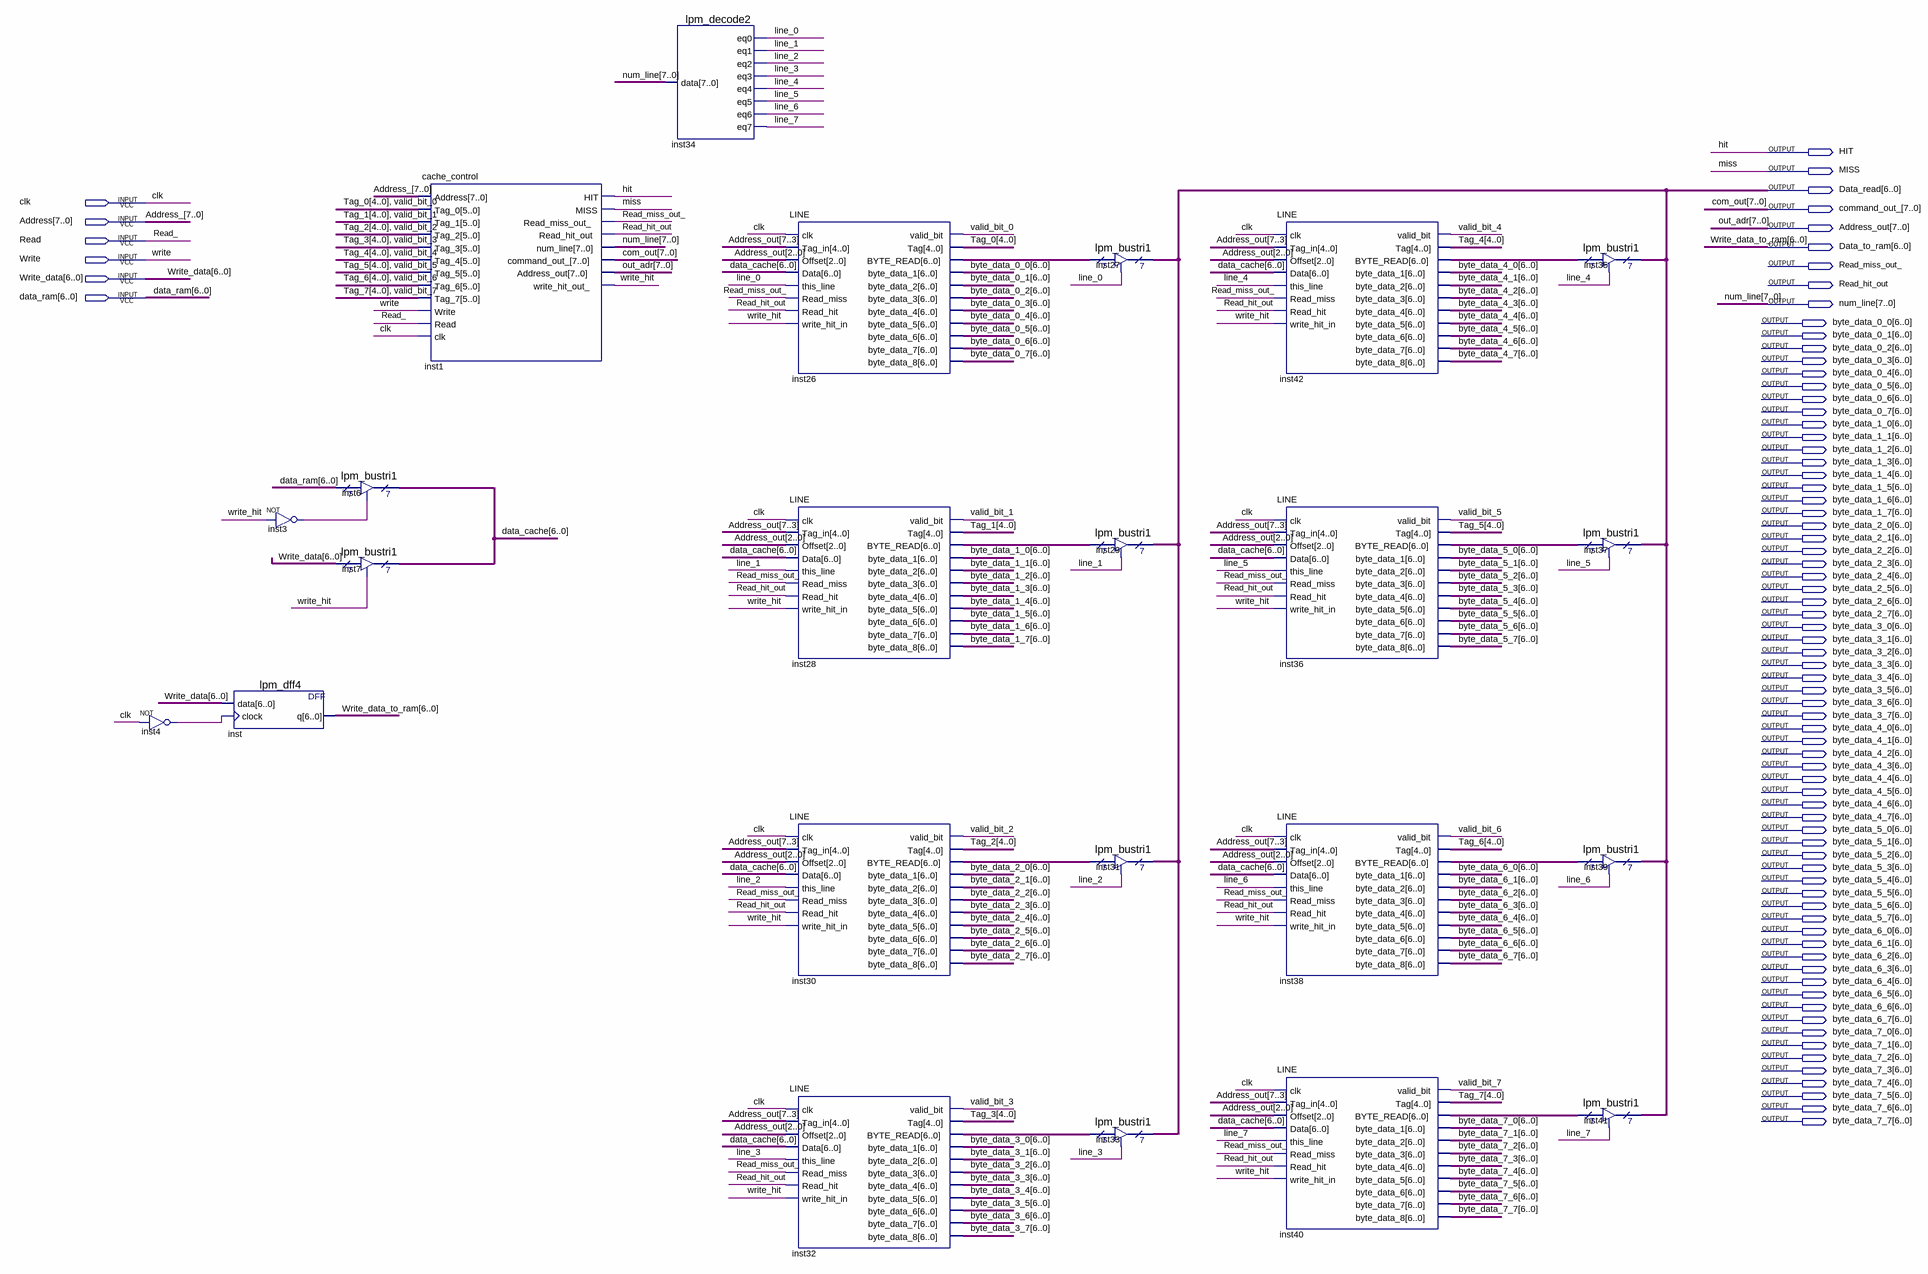
[diagram p0: schematic sheet]
// Quartus schematic CACHE.bdf as structural Verilog: 23 symbols, 79 pins
module CACHE (
  input  clk,
  input  [7:0] Address,
  input  Read,
  input  Write,
  input  [6:0] Write_data,
  input  [6:0] data_ram,
  output HIT,
  output MISS,
  output [6:0] Data_read,
  output [7:0] command_out_,
  output [7:0] Address_out,
  output [6:0] Data_to_ram,
  output Read_miss_out_,
  output Read_hit_out,
  output [7:0] num_line,
  output [6:0] byte_data_0_0,
  output [6:0] byte_data_0_1,
  output [6:0] byte_data_0_2,
  output [6:0] byte_data_0_3,
  output [6:0] byte_data_0_4,
  output [6:0] byte_data_0_5,
  output [6:0] byte_data_0_6,
  output [6:0] byte_data_0_7,
  output [6:0] byte_data_1_0,
  output [6:0] byte_data_1_1,
  output [6:0] byte_data_1_2,
  output [6:0] byte_data_1_3,
  output [6:0] byte_data_1_4,
  output [6:0] byte_data_1_5,
  output [6:0] byte_data_1_6,
  output [6:0] byte_data_1_7,
  output [6:0] byte_data_2_0,
  output [6:0] byte_data_2_1,
  output [6:0] byte_data_2_2,
  output [6:0] byte_data_2_3,
  output [6:0] byte_data_2_4,
  output [6:0] byte_data_2_5,
  output [6:0] byte_data_2_6,
  output [6:0] byte_data_2_7,
  output [6:0] byte_data_3_0,
  output [6:0] byte_data_3_1,
  output [6:0] byte_data_3_2,
  output [6:0] byte_data_3_3,
  output [6:0] byte_data_3_4,
  output [6:0] byte_data_3_5,
  output [6:0] byte_data_3_6,
  output [6:0] byte_data_3_7,
  output [6:0] byte_data_4_0,
  output [6:0] byte_data_4_1,
  output [6:0] byte_data_4_2,
  output [6:0] byte_data_4_3,
  output [6:0] byte_data_4_4,
  output [6:0] byte_data_4_5,
  output [6:0] byte_data_4_6,
  output [6:0] byte_data_4_7,
  output [6:0] byte_data_5_0,
  output [6:0] byte_data_5_1,
  output [6:0] byte_data_5_2,
  output [6:0] byte_data_5_3,
  output [6:0] byte_data_5_4,
  output [6:0] byte_data_5_5,
  output [6:0] byte_data_5_6,
  output [6:0] byte_data_5_7,
  output [6:0] byte_data_6_0,
  output [6:0] byte_data_6_1,
  output [6:0] byte_data_6_2,
  output [6:0] byte_data_6_3,
  output [6:0] byte_data_6_4,
  output [6:0] byte_data_6_5,
  output [6:0] byte_data_6_6,
  output [6:0] byte_data_6_7,
  output [6:0] byte_data_7_0,
  output [6:0] byte_data_7_1,
  output [6:0] byte_data_7_2,
  output [6:0] byte_data_7_3,
  output [6:0] byte_data_7_4,
  output [6:0] byte_data_7_5,
  output [6:0] byte_data_7_6,
  output [6:0] byte_data_7_7
);

  wire inst3_out, inst4_out, line_0, line_1, line_2, line_3, line_4, line_5, line_6, line_7, valid_bit_0,
       valid_bit_1, valid_bit_2, valid_bit_3, valid_bit_4, valid_bit_5, valid_bit_6, valid_bit_7, write_hit;
  wire [4:0] Tag_0, Tag_1, Tag_2, Tag_3, Tag_4, Tag_5, Tag_6, Tag_7;
  wire [6:0] data_cache, inst26_byte_read, inst28_byte_read, inst30_byte_read, inst32_byte_read,
       inst36_byte_read, inst38_byte_read, inst40_byte_read, inst42_byte_read;

  not inst4 (inst4_out, clk);
  lpm_dff4 inst (.data(Write_data), .clock(inst4_out), .q(Data_to_ram));
  not inst3 (inst3_out, write_hit);
  lpm_bustri1 inst6 (.enabledt(inst3_out), .data(data_ram), .tridata(data_cache));
  lpm_bustri1 inst7 (.enabledt(write_hit), .data(Write_data), .tridata(data_cache));
  cache_control inst1 (
    .Address(Address), .Tag_0({Tag_0, valid_bit_0}), .Tag_1({Tag_1, valid_bit_1}),
    .Tag_2({Tag_2, valid_bit_2}), .Tag_3({Tag_3, valid_bit_3}), .Tag_4({Tag_4, valid_bit_4}),
    .Tag_5({Tag_5, valid_bit_5}), .Tag_6({Tag_6, valid_bit_6}), .Tag_7({Tag_7, valid_bit_7}), .Write(Write),
    .Read(Read), .clk(clk), .HIT(HIT), .MISS(MISS), .Read_miss_out_(Read_miss_out_),
    .Read_hit_out(Read_hit_out), .num_line(num_line), .command_out_(command_out_), .Address_out(Address_out),
    .write_hit_out_(write_hit));
  lpm_decode2 inst34 (
    .data(num_line), .eq0(line_0), .eq1(line_1), .eq2(line_2), .eq3(line_3), .eq4(line_4), .eq5(line_5),
    .eq6(line_6), .eq7(line_7));
  LINE inst26 (
    .clk(clk), .Tag_in(Address_out[7:3]), .Offset(Address_out[2:0]), .Data(data_cache), .this_line(line_0),
    .Read_miss(Read_miss_out_), .Read_hit(Read_hit_out), .write_hit_in(write_hit), .valid_bit(valid_bit_0),
    .Tag(Tag_0), .BYTE_READ(inst26_byte_read), .byte_data_1(byte_data_0_0), .byte_data_2(byte_data_0_1),
    .byte_data_3(byte_data_0_2), .byte_data_4(byte_data_0_3), .byte_data_5(byte_data_0_4),
    .byte_data_6(byte_data_0_5), .byte_data_7(byte_data_0_6), .byte_data_8(byte_data_0_7));
  LINE inst28 (
    .clk(clk), .Tag_in(Address_out[7:3]), .Offset(Address_out[2:0]), .Data(data_cache), .this_line(line_1),
    .Read_miss(Read_miss_out_), .Read_hit(Read_hit_out), .write_hit_in(write_hit), .valid_bit(valid_bit_1),
    .Tag(Tag_1), .BYTE_READ(inst28_byte_read), .byte_data_1(byte_data_1_0), .byte_data_2(byte_data_1_1),
    .byte_data_3(byte_data_1_2), .byte_data_4(byte_data_1_3), .byte_data_5(byte_data_1_4),
    .byte_data_6(byte_data_1_5), .byte_data_7(byte_data_1_6), .byte_data_8(byte_data_1_7));
  LINE inst30 (
    .clk(clk), .Tag_in(Address_out[7:3]), .Offset(Address_out[2:0]), .Data(data_cache), .this_line(line_2),
    .Read_miss(Read_miss_out_), .Read_hit(Read_hit_out), .write_hit_in(write_hit), .valid_bit(valid_bit_2),
    .Tag(Tag_2), .BYTE_READ(inst30_byte_read), .byte_data_1(byte_data_2_0), .byte_data_2(byte_data_2_1),
    .byte_data_3(byte_data_2_2), .byte_data_4(byte_data_2_3), .byte_data_5(byte_data_2_4),
    .byte_data_6(byte_data_2_5), .byte_data_7(byte_data_2_6), .byte_data_8(byte_data_2_7));
  LINE inst32 (
    .clk(clk), .Tag_in(Address_out[7:3]), .Offset(Address_out[2:0]), .Data(data_cache), .this_line(line_3),
    .Read_miss(Read_miss_out_), .Read_hit(Read_hit_out), .write_hit_in(write_hit), .valid_bit(valid_bit_3),
    .Tag(Tag_3), .BYTE_READ(inst32_byte_read), .byte_data_1(byte_data_3_0), .byte_data_2(byte_data_3_1),
    .byte_data_3(byte_data_3_2), .byte_data_4(byte_data_3_3), .byte_data_5(byte_data_3_4),
    .byte_data_6(byte_data_3_5), .byte_data_7(byte_data_3_6), .byte_data_8(byte_data_3_7));
  lpm_bustri1 inst27 (.enabledt(line_0), .data(inst26_byte_read), .tridata(Data_read));
  lpm_bustri1 inst29 (.enabledt(line_1), .data(inst28_byte_read), .tridata(Data_read));
  lpm_bustri1 inst31 (.enabledt(line_2), .data(inst30_byte_read), .tridata(Data_read));
  lpm_bustri1 inst33 (.enabledt(line_3), .data(inst32_byte_read), .tridata(Data_read));
  LINE inst42 (
    .clk(clk), .Tag_in(Address_out[7:3]), .Offset(Address_out[2:0]), .Data(data_cache), .this_line(line_4),
    .Read_miss(Read_miss_out_), .Read_hit(Read_hit_out), .write_hit_in(write_hit), .valid_bit(valid_bit_4),
    .Tag(Tag_4), .BYTE_READ(inst42_byte_read), .byte_data_1(byte_data_4_0), .byte_data_2(byte_data_4_1),
    .byte_data_3(byte_data_4_2), .byte_data_4(byte_data_4_3), .byte_data_5(byte_data_4_4),
    .byte_data_6(byte_data_4_5), .byte_data_7(byte_data_4_6), .byte_data_8(byte_data_4_7));
  LINE inst36 (
    .clk(clk), .Tag_in(Address_out[7:3]), .Offset(Address_out[2:0]), .Data(data_cache), .this_line(line_5),
    .Read_miss(Read_miss_out_), .Read_hit(Read_hit_out), .write_hit_in(write_hit), .valid_bit(valid_bit_5),
    .Tag(Tag_5), .BYTE_READ(inst36_byte_read), .byte_data_1(byte_data_5_0), .byte_data_2(byte_data_5_1),
    .byte_data_3(byte_data_5_2), .byte_data_4(byte_data_5_3), .byte_data_5(byte_data_5_4),
    .byte_data_6(byte_data_5_5), .byte_data_7(byte_data_5_6), .byte_data_8(byte_data_5_7));
  LINE inst38 (
    .clk(clk), .Tag_in(Address_out[7:3]), .Offset(Address_out[2:0]), .Data(data_cache), .this_line(line_6),
    .Read_miss(Read_miss_out_), .Read_hit(Read_hit_out), .write_hit_in(write_hit), .valid_bit(valid_bit_6),
    .Tag(Tag_6), .BYTE_READ(inst38_byte_read), .byte_data_1(byte_data_6_0), .byte_data_2(byte_data_6_1),
    .byte_data_3(byte_data_6_2), .byte_data_4(byte_data_6_3), .byte_data_5(byte_data_6_4),
    .byte_data_6(byte_data_6_5), .byte_data_7(byte_data_6_6), .byte_data_8(byte_data_6_7));
  LINE inst40 (
    .clk(clk), .Tag_in(Address_out[7:3]), .Offset(Address_out[2:0]), .Data(data_cache), .this_line(line_7),
    .Read_miss(Read_miss_out_), .Read_hit(Read_hit_out), .write_hit_in(write_hit), .valid_bit(valid_bit_7),
    .Tag(Tag_7), .BYTE_READ(inst40_byte_read), .byte_data_1(byte_data_7_0), .byte_data_2(byte_data_7_1),
    .byte_data_3(byte_data_7_2), .byte_data_4(byte_data_7_3), .byte_data_5(byte_data_7_4),
    .byte_data_6(byte_data_7_5), .byte_data_7(byte_data_7_6), .byte_data_8(byte_data_7_7));
  lpm_bustri1 inst35 (.enabledt(line_4), .data(inst42_byte_read), .tridata(Data_read));
  lpm_bustri1 inst37 (.enabledt(line_5), .data(inst36_byte_read), .tridata(Data_read));
  lpm_bustri1 inst39 (.enabledt(line_6), .data(inst38_byte_read), .tridata(Data_read));
  lpm_bustri1 inst41 (.enabledt(line_7), .data(inst40_byte_read), .tridata(Data_read));

  // Other names for the same wires on the sheet: Address_[7:0] = Address; com_out[7:0] = command_out_;
  //   out_adr[7:0] = Address_out; Read_ = Read; Write_data_to_ram[6:0] = Data_to_ram
endmodule
